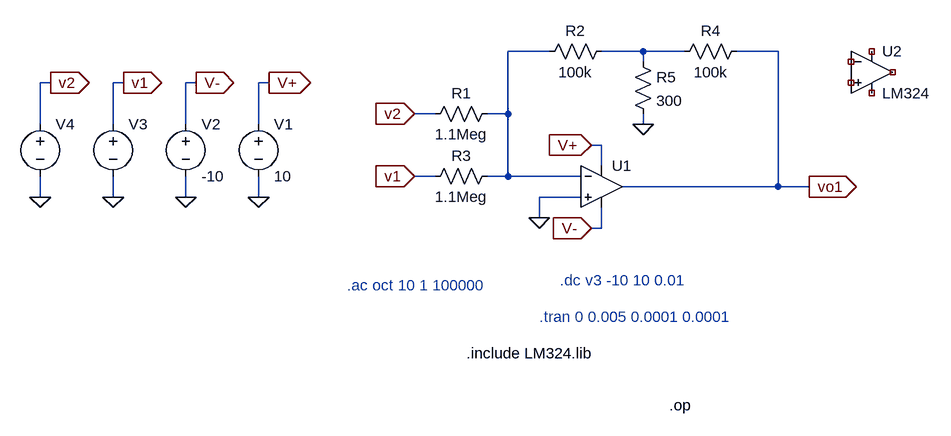
[diagram p0: schematic TP2_C2.asc]
TP2_C2.asc, the LTspice schematic file:
Version 4.1
SHEET 1 1508 680
WIRE 112 -176 48 -176
WIRE 256 -176 192 -176
WIRE 320 -176 256 -176
WIRE 464 -176 400 -176
WIRE 256 -160 256 -176
WIRE -656 -128 -672 -128
WIRE -544 -128 -560 -128
WIRE -432 -128 -448 -128
WIRE -320 -128 -336 -128
WIRE -64 -80 -96 -80
WIRE 48 -80 48 -176
WIRE 48 -80 16 -80
WIRE -672 -64 -672 -128
WIRE -560 -64 -560 -128
WIRE -448 -64 -448 -128
WIRE -336 -64 -336 -128
WIRE 256 -64 256 -80
WIRE 192 -32 176 -32
WIRE 192 0 192 -32
WIRE -64 16 -96 16
WIRE 48 16 48 -80
WIRE 48 16 16 16
WIRE 160 16 48 16
WIRE 464 32 464 -176
WIRE 464 32 224 32
WIRE 512 32 464 32
WIRE -672 48 -672 16
WIRE -560 48 -560 16
WIRE -448 48 -448 16
WIRE -336 48 -336 16
WIRE 160 48 96 48
WIRE 96 80 96 48
WIRE 192 96 192 64
WIRE 192 96 176 96
FLAG -320 -128 V+
IOPIN -320 -128 Out
FLAG -336 48 0
FLAG -432 -128 V-
IOPIN -432 -128 Out
FLAG -448 48 0
FLAG -544 -128 v1
IOPIN -544 -128 Out
FLAG -560 48 0
FLAG -656 -128 v2
IOPIN -656 -128 Out
FLAG -672 48 0
FLAG 512 32 vo1
IOPIN 512 32 Out
FLAG -96 16 v1
IOPIN -96 16 In
FLAG 176 -32 V+
IOPIN 176 -32 In
FLAG 176 96 V-
IOPIN 176 96 In
FLAG -96 -80 v2
IOPIN -96 -80 In
FLAG 96 80 0
FLAG 256 -64 0
SYMBOL voltage -336 -80 R0
WINDOW 123 0 0 Left 0
WINDOW 39 0 0 Left 0
SYMATTR InstName V1
SYMATTR Value 10
SYMBOL voltage -448 -80 R0
WINDOW 123 0 0 Left 0
WINDOW 39 0 0 Left 0
SYMATTR InstName V2
SYMATTR Value -10
SYMBOL voltage -560 -80 R0
WINDOW 123 24 44 Left 2
WINDOW 39 0 0 Left 0
WINDOW 3 24 72 Left 2
SYMATTR InstName V3
SYMATTR Value ""
SYMBOL voltage -672 -80 R0
WINDOW 3 20 95 Left 2
WINDOW 123 19 126 Left 2
WINDOW 39 0 0 Left 0
SYMATTR Value ""
SYMATTR InstName V4
SYMBOL res 208 -192 R90
WINDOW 0 0 56 VBottom 2
WINDOW 3 32 56 VTop 2
SYMATTR InstName R2
SYMATTR Value 100k
SYMBOL res 32 0 R90
WINDOW 0 0 56 VBottom 2
WINDOW 3 32 56 VTop 2
SYMATTR InstName R3
SYMATTR Value 1.1Meg
SYMBOL res 32 -96 R90
WINDOW 0 0 56 VBottom 2
WINDOW 3 32 56 VTop 2
SYMATTR InstName R1
SYMATTR Value 1.1Meg
SYMBOL res 416 -192 R90
WINDOW 0 0 56 VBottom 2
WINDOW 3 32 56 VTop 2
SYMATTR InstName R4
SYMATTR Value 100k
SYMBOL res 240 -176 R0
SYMATTR InstName R5
SYMATTR Value 300
SYMBOL OpAmps\\UniversalOpAmp2 192 32 R0
SYMATTR InstName U1
SYMATTR Value2 Avol=1T GBW=1Meg Slew=10Meg
SYMATTR SpiceLine Ilimit=25m Rail=0 Vos=2m
SYMBOL OpAmps\\opamp2 608 -208 R0
SYMATTR InstName U2
SYMATTR Value LM324
TEXT -200 184 Left 2 ;.ac oct 10 1 100000
TEXT 128 176 Left 2 ;.dc v3 -10 10 0.01
TEXT -16 288 Left 2 !.include LM324.lib
TEXT 96 232 Left 2 ;.tran 0 0.005 0.0001 0.0001
TEXT 296 368 Left 2 !.op

The netlist it stands for:
* TP2_C2.asc
V1 V+ 0 10
V2 V- 0 -10
V3 v1 0
V4 v2 0
R2 N002 N001 100k
R3 N001 v1 1.1Meg
R1 N001 v2 1.1Meg
R4 vo1 N002 100k
R5 N002 0 300
X§U1 0 N001 V+ V- vo1 level2 Avol=1T GBW=1Meg Slew=10Meg Ilimit=25m Rail=0 Vos=2m En=0 Enk=0 In=0 Ink=0 Rin=500Meg  ; pins In+ In- V+ V- OUT
X§U2 NC_01 NC_02 NC_03 NC_04 NC_05 LM324  ; pins In+ In- V+ V- OUT
* .ac oct 10 1 100000
* .dc v3 -10 10 0.01
.include LM324.lib
* .tran 0 0.005 0.0001 0.0001
.op
.lib UniversalOpAmp2.lib
.backanno
.end